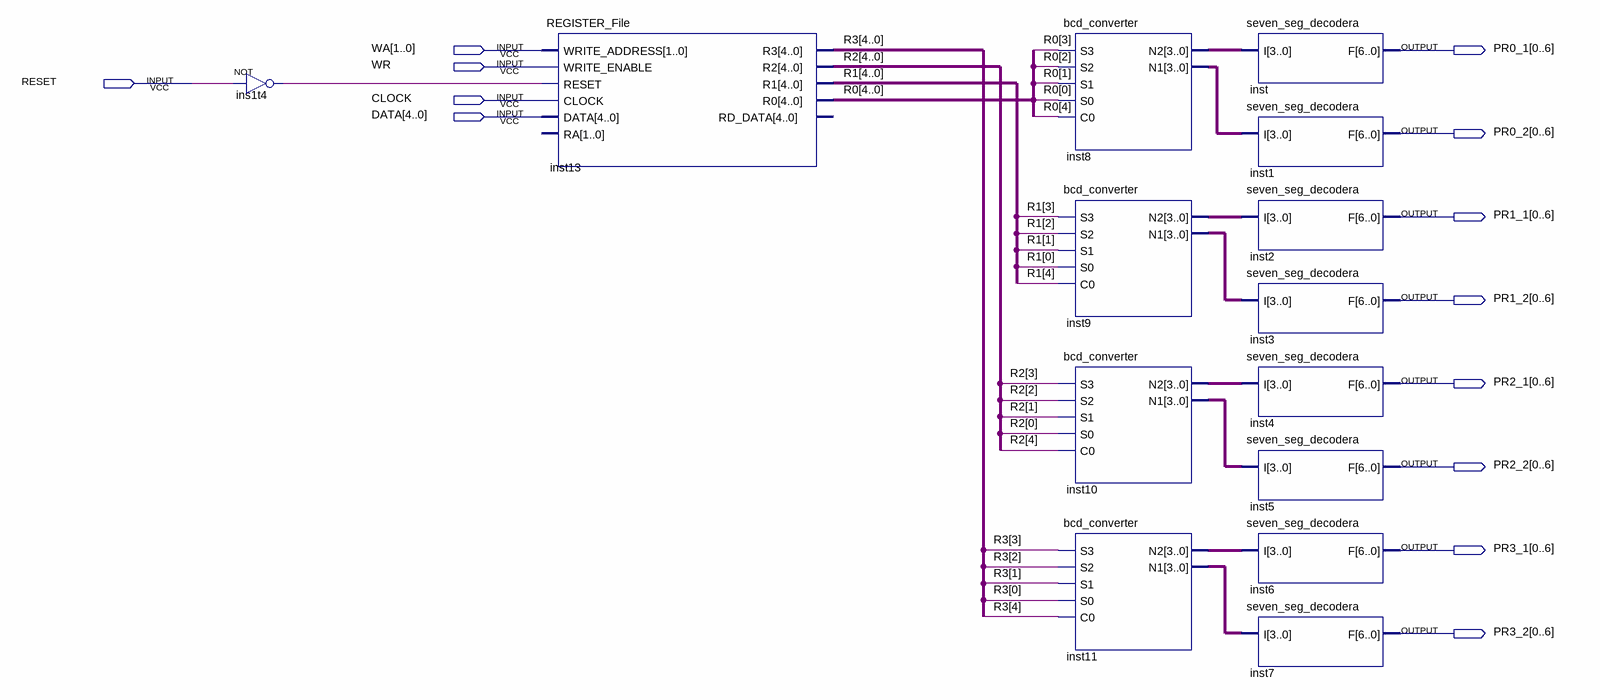
[diagram p0: schematic sheet]
// Quartus schematic REGISTER_FILE_COMPLETE.bdf as structural Verilog: 14 symbols, 13 pins
module REGISTER_FILE_COMPLETE (
  input  [1:0] WA,
  input  WR,
  input  RESET,
  input  CLOCK,
  input  [4:0] DATA,
  output [0:6] PR0_1,
  output [0:6] PR0_2,
  output [0:6] PR1_1,
  output [0:6] PR1_2,
  output [0:6] PR2_1,
  output [0:6] PR2_2,
  output [0:6] PR3_1,
  output [0:6] PR3_2
);

  wire ins1t4_out;
  wire [3:0] inst8_n1, inst8_n2, inst9_n1, inst9_n2, inst10_n1, inst10_n2, inst11_n1, inst11_n2;
  wire [4:0] R0, R1, R2, R3;

  not ins1t4 (ins1t4_out, RESET);
  REGISTER_File inst13 (
    .WRITE_ADDRESS(WA), .WRITE_ENABLE(WR), .RESET(ins1t4_out), .CLOCK(CLOCK), .DATA(DATA), .R3(R3), .R2(R2),
    .R1(R1), .R0(R0));  // open: RA, RD_DATA
  bcd_converter inst8 (.S3(R0[3]), .S2(R0[2]), .S1(R0[1]), .S0(R0[0]), .C0(R0[4]), .N2(inst8_n2), .N1(inst8_n1));
  bcd_converter inst9 (.S3(R1[3]), .S2(R1[2]), .S1(R1[1]), .S0(R1[0]), .C0(R1[4]), .N2(inst9_n2), .N1(inst9_n1));
  bcd_converter inst10 (.S3(R2[3]), .S2(R2[2]), .S1(R2[1]), .S0(R2[0]), .C0(R2[4]), .N2(inst10_n2), .N1(inst10_n1));
  bcd_converter inst11 (.S3(R3[3]), .S2(R3[2]), .S1(R3[1]), .S0(R3[0]), .C0(R3[4]), .N2(inst11_n2), .N1(inst11_n1));
  seven_seg_decodera inst (.I(inst8_n2), .F(PR0_1));
  seven_seg_decodera inst1 (.I(inst8_n1), .F(PR0_2));
  seven_seg_decodera inst2 (.I(inst9_n2), .F(PR1_1));
  seven_seg_decodera inst3 (.I(inst9_n1), .F(PR1_2));
  seven_seg_decodera inst4 (.I(inst10_n2), .F(PR2_1));
  seven_seg_decodera inst5 (.I(inst10_n1), .F(PR2_2));
  seven_seg_decodera inst6 (.I(inst11_n2), .F(PR3_1));
  seven_seg_decodera inst7 (.I(inst11_n1), .F(PR3_2));
endmodule
